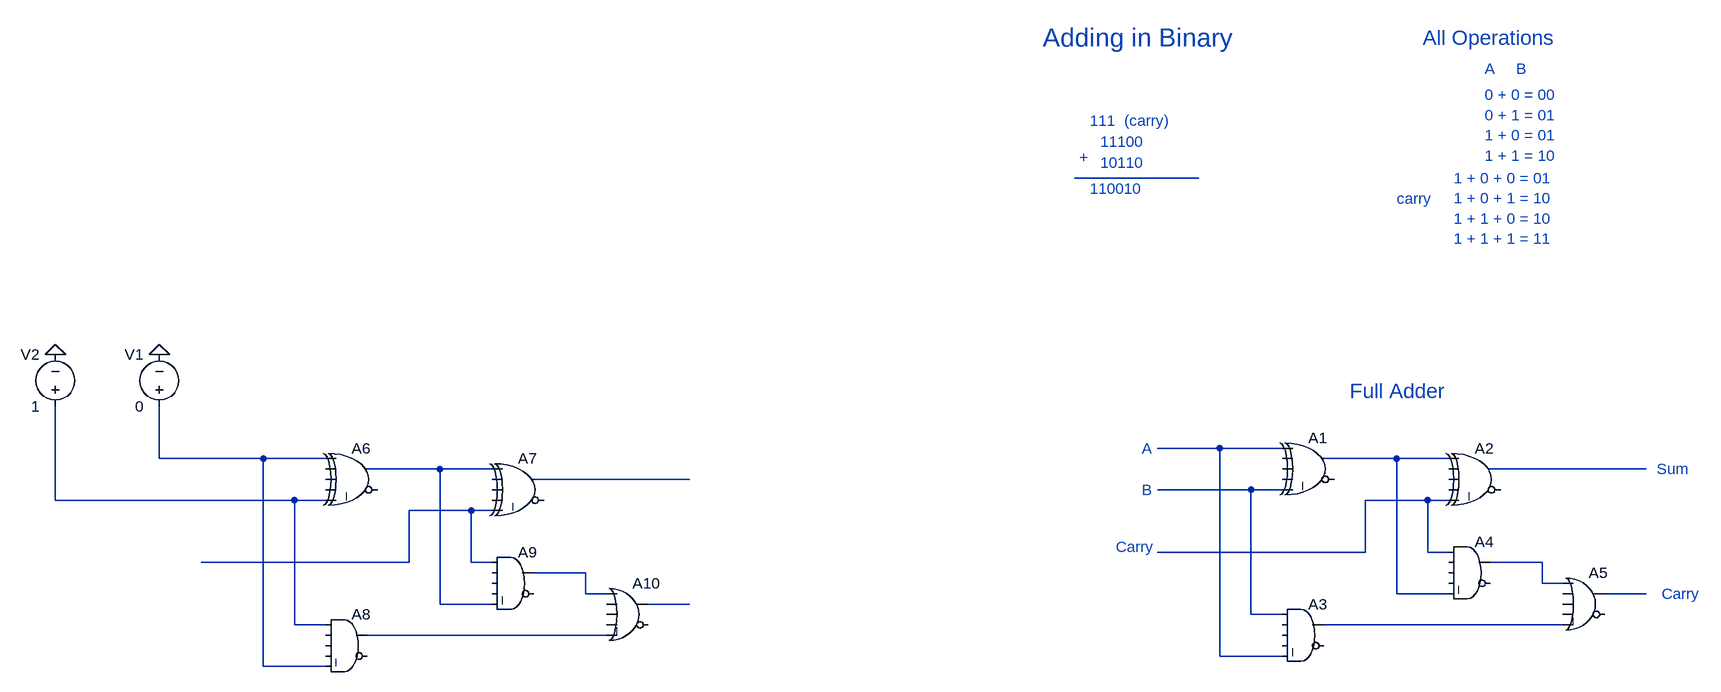
[diagram p0: schematic ALU.asc]
ALU.asc, the LTspice schematic file:
Version 4
SHEET 1 1116 1064
WIRE 336 304 144 304
WIRE 368 720 272 720
WIRE 464 720 368 720
WIRE -1264 736 -1264 656
WIRE -1104 736 -1264 736
WIRE -1008 736 -1104 736
WIRE 640 736 528 736
WIRE 720 736 640 736
WIRE -832 752 -944 752
WIRE -752 752 -832 752
WIRE 1024 752 784 752
WIRE -448 768 -688 768
WIRE 416 784 272 784
WIRE 464 784 416 784
WIRE -1424 800 -1424 656
WIRE -1056 800 -1424 800
WIRE -1008 800 -1056 800
WIRE 688 800 592 800
WIRE 720 800 688 800
WIRE -784 816 -880 816
WIRE -752 816 -784 816
WIRE 592 880 592 800
WIRE 592 880 272 880
WIRE 688 880 688 800
WIRE 720 880 688 880
WIRE -880 896 -880 816
WIRE -880 896 -1200 896
WIRE -784 896 -784 816
WIRE -752 896 -784 896
WIRE 864 896 784 896
WIRE -608 912 -688 912
WIRE 864 928 864 896
WIRE 896 928 864 928
WIRE -608 944 -608 912
WIRE -576 944 -608 944
WIRE 640 944 640 736
WIRE 720 944 640 944
WIRE 1024 944 960 944
WIRE -832 960 -832 752
WIRE -752 960 -832 960
WIRE -448 960 -512 960
WIRE 416 976 416 784
WIRE 464 976 416 976
WIRE -1056 992 -1056 800
WIRE -1008 992 -1056 992
WIRE 896 992 528 992
WIRE -576 1008 -944 1008
WIRE 368 1040 368 720
WIRE 464 1040 368 1040
WIRE -1104 1056 -1104 736
WIRE -1008 1056 -1104 1056
FLAG -1424 576 0
FLAG -1264 576 0
SYMBOL Digital\\xor 512 688 R0
SYMATTR InstName A1
SYMBOL Digital\\xor 768 704 R0
SYMATTR InstName A2
SYMBOL Digital\\and 496 944 R0
SYMATTR InstName A3
SYMBOL Digital\\and 752 848 R0
SYMATTR InstName A4
SYMBOL Digital\\or 928 896 R0
SYMATTR InstName A5
SYMBOL Digital\\xor -960 704 R0
SYMATTR InstName A6
SYMBOL Digital\\xor -704 720 R0
SYMATTR InstName A7
SYMBOL Digital\\and -976 960 R0
SYMATTR InstName A8
SYMBOL Digital\\and -720 864 R0
SYMATTR InstName A9
SYMBOL Digital\\or -544 912 R0
SYMATTR InstName A10
SYMBOL voltage -1264 672 R180
WINDOW 0 24 96 Left 2
WINDOW 3 24 16 Left 2
WINDOW 123 0 0 Left 0
WINDOW 39 0 0 Left 0
SYMATTR InstName V1
SYMATTR Value 0
SYMBOL voltage -1424 672 R180
WINDOW 0 24 96 Left 2
WINDOW 3 24 16 Left 2
WINDOW 123 0 0 Left 0
WINDOW 39 0 0 Left 0
SYMATTR InstName V2
SYMATTR Value 1
TEXT 96 88 Left 4 ;Adding in Binary
TEXT 168 216 Left 2 ;111  (carry)
TEXT 184 248 Left 2 ;11100
TEXT 152 272 Left 2 ;+
TEXT 184 280 Left 2 ;10110
TEXT 168 320 Left 2 ;110010
TEXT 680 88 Left 3 ;All Operations
TEXT 776 176 Left 2 ;0 + 0 = 00\n0 + 1 = 01\n1 + 0 = 01\n1 + 1 = 10
TEXT 776 136 Left 2 ;A
TEXT 824 136 Left 2 ;B
TEXT 728 304 Left 2 ;1 + 0 + 0 = 01\n1 + 0 + 1 = 10\n1 + 1 + 0 = 10\n1 + 1 + 1 = 11
TEXT 640 336 Left 2 ;carry
TEXT 248 720 Left 2 ;A
TEXT 248 784 Left 2 ;B
TEXT 208 872 Left 2 ;Carry
TEXT 1040 752 Left 2 ;Sum
TEXT 1048 944 Left 2 ;Carry
TEXT 568 632 Left 3 ;Full Adder

The netlist it stands for:
* ALU.asc
A1 N002 0 0 0 N008 0 N004 0 XOR
A2 N004 0 0 0 N010 0 N006 0 XOR
A3 N008 0 0 0 N002 0 N016 0 AND
A4 N010 0 0 0 N004 0 N012 0 AND
A5 N012 0 0 0 N016 0 N014 0 OR
A6 N003 0 0 0 N009 0 N005 0 XOR
A7 N005 0 0 0 N011 0 N007 0 XOR
A8 N009 0 0 0 N003 0 N017 0 AND
A9 N011 0 0 0 N005 0 N013 0 AND
A10 N013 0 0 0 N017 0 N015 0 OR
V1 N003 0 0
V2 N009 0 1
* Adding in Binary
* 111  (carry)
* 11100
* +
* 10110
* 110010
* All Operations
* 0 + 0 = 00
* 0 + 1 = 01
* 1 + 0 = 01
* 1 + 1 = 10
* A
* B
* 1 + 0 + 0 = 01
* 1 + 0 + 1 = 10
* 1 + 1 + 0 = 10
* 1 + 1 + 1 = 11
* carry
* A
* B
* Carry
* Sum
* Carry
* Full Adder
.backanno
.end